# Altium schematic sheet [03] - miniPCI.SchDoc
size A0
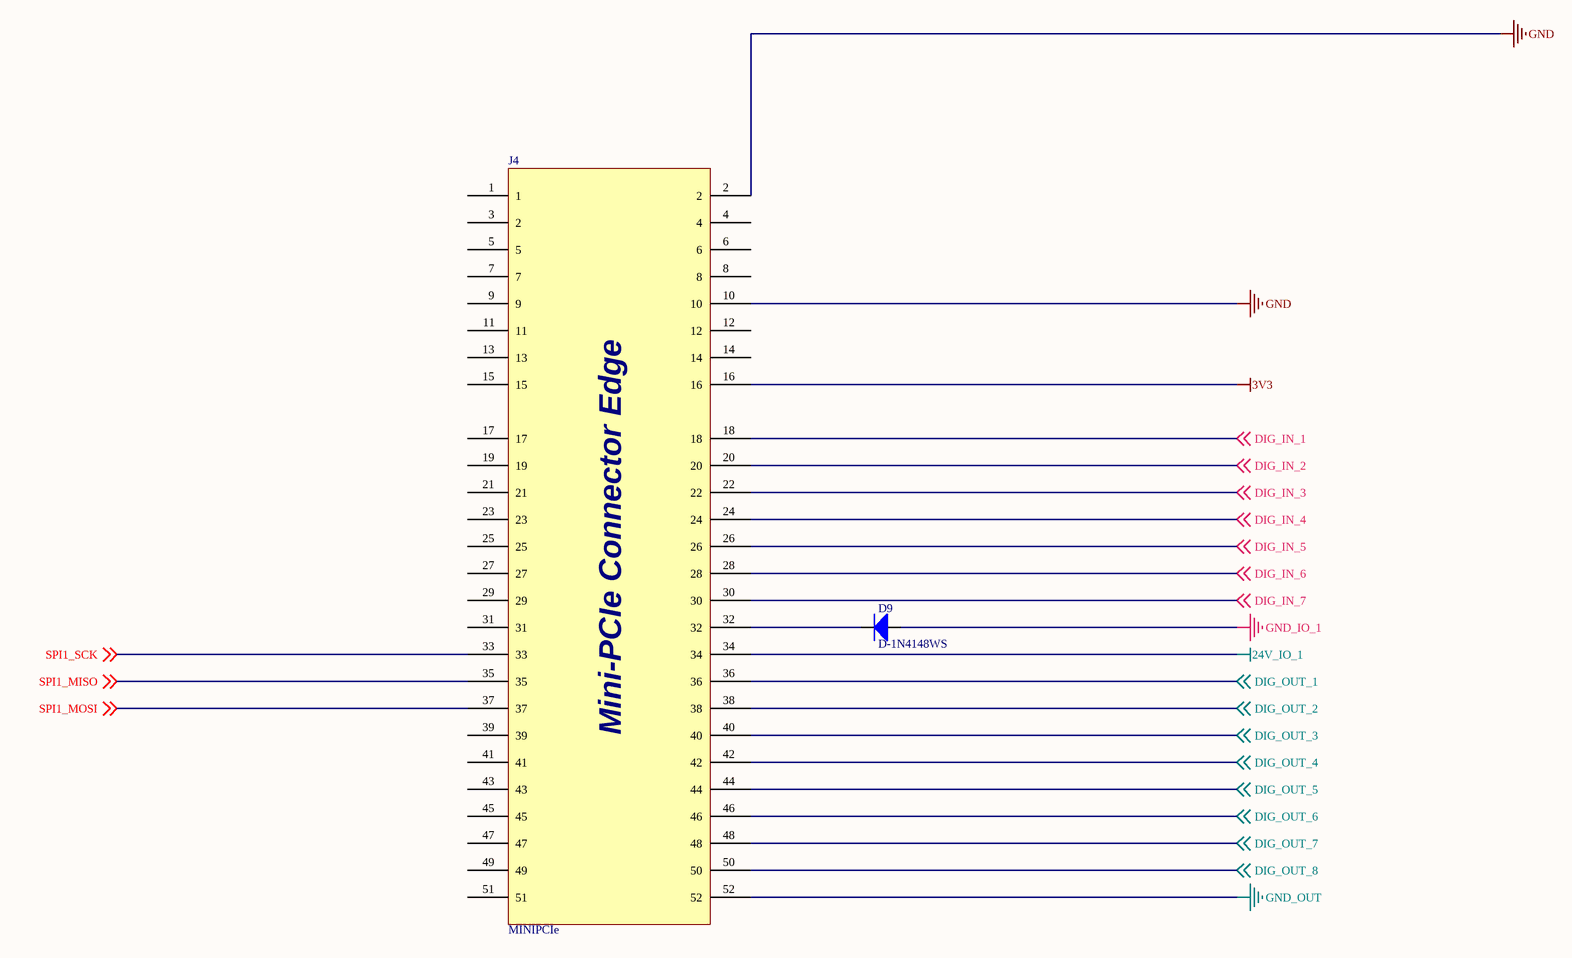
[diagram p0: [03] - miniPCI.SchDoc]

## Parts
D9  D-1N4148WS  [SOD-323]
J4  MINIPCIe  [MINI PCIe]

## Nets
3V3: J4.16
24V_IO_1: J4.34
GND: J4.2 J4.10
GND_IO_1: D9.2
GND_OUT: J4.52
DIG_IN_1: J4.18 ; off-sheet DIG_IN_1
DIG_IN_2: J4.20 ; off-sheet DIG_IN_2
DIG_IN_3: J4.22 ; off-sheet DIG_IN_3
DIG_IN_4: J4.24 ; off-sheet DIG_IN_4
DIG_IN_5: J4.26 ; off-sheet DIG_IN_5
DIG_IN_6: J4.28 ; off-sheet DIG_IN_6
DIG_IN_7: J4.30 ; off-sheet DIG_IN_7
DIG_OUT_1: J4.36 ; off-sheet DIG_OUT_1
DIG_OUT_2: J4.38 ; off-sheet DIG_OUT_2
DIG_OUT_3: J4.40 ; off-sheet DIG_OUT_3
DIG_OUT_4: J4.42 ; off-sheet DIG_OUT_4
DIG_OUT_5: J4.44 ; off-sheet DIG_OUT_5
DIG_OUT_6: J4.46 ; off-sheet DIG_OUT_6
DIG_OUT_7: J4.48 ; off-sheet DIG_OUT_7
DIG_OUT_8: J4.50 ; off-sheet DIG_OUT_8
SPI1_MISO: J4.35 ; off-sheet SPI1_MISO
SPI1_MOSI: J4.37 ; off-sheet SPI1_MOSI
SPI1_SCK: J4.33 ; off-sheet SPI1_SCK
NetD9_1: D9.1 J4.32

Not connected (* = marked no-connect by the designer): J4 1 3(2) 4 5 6 7 8 9 11 12 13 14 15 17 19 21 23 25 27 29 31 39 41 43 45 47 49 51

## Notes on the sheet
- (in symbol MINIPCIe) Mini-PCIe Connector Edge

## Library data of the parts
D9 = D-1N4148WS: DIODES INC. - 1N4148WS-7-F - DIODE, SS SWITCH, 75V, 0.2W, SOD323; Diode Configuration: Single; Repetitive Reverse Voltage Vrrm Max: 75; Forward Current If(AV): 150; Forward Voltage VF Max: 1.25; Reverse Recovery Time trr Max: 4; Forward Surge Current Ifsm Max: 2; Product Range: 1N4148 Series; SVHC: No SVHC (17-Dec-2015); Diode Type: Switching; Supplier 1: Farnell; Manufacturer: DIODES INC.; Manufacturer Part Number: 1N4148WS-7-F; RoHS: YES; Stock 1: 52116; Pricing 1: 1=0.186, 25=0.142, 100=0.0928, 250=0.0514, 500=0.0433, 1000=0.0256, 3000=0.025, 8000=0.0239 (GBP); Operating Temperature Max: 150; Diode Case Style: SOD-323; No. of Pins: 2; Packaging: Cut Tape; MSL: MSL 1 - Unlimited; Operating Temperature Min: -65; Operating Temperature Range: -65°C to +150°C<!--FANDB--><div class="features-and-benefits-container"><div class="features-and-benefits-description"><span class="features-benefits-value">The 1N4148WS-7-F is a surface mount fast Switching Diode with matte tin-plated terminals and an UL94V-0 green molding compound molded plastic case. Solderable terminals as per MIL-STD-202, method 208 standard. Color band denotes cathode end polarity. It is suitable for general purpose switching applications.</span></div><div class="features-and-benefits-list"><ul class="features-and-benefits-list-list"><li class="features-and-benefits-list-item">Fast switching speed</li><li class="features-and-benefits-list-item">100V Non-repetitive peak reverse voltage</li><li class="features-and-benefits-list-item">53V RMS reverse voltage</li><li class="features-and-benefits-list-item">200mW Power dissipation</li><li class="features-and-benefits-list-item">625; ComponentLink1URL: http://www.farnell.com/datasheets/1911818.pdf; ComponentLink1Description: http://www.farnell.com/datasheets/1911818.pdf; Supplier Part Number 1: 1843678